# Altium schematic sheet 401_FramePWR.schdoc: Framework Modules Power
size A2; Organization: Greenfield Tech Solutions; Address1: Molendreef 33; Address2: Ossendrecht; Address3: 4641CS; Address4: The Netherlands; SheetNumber: 5; SheetTotal: 9
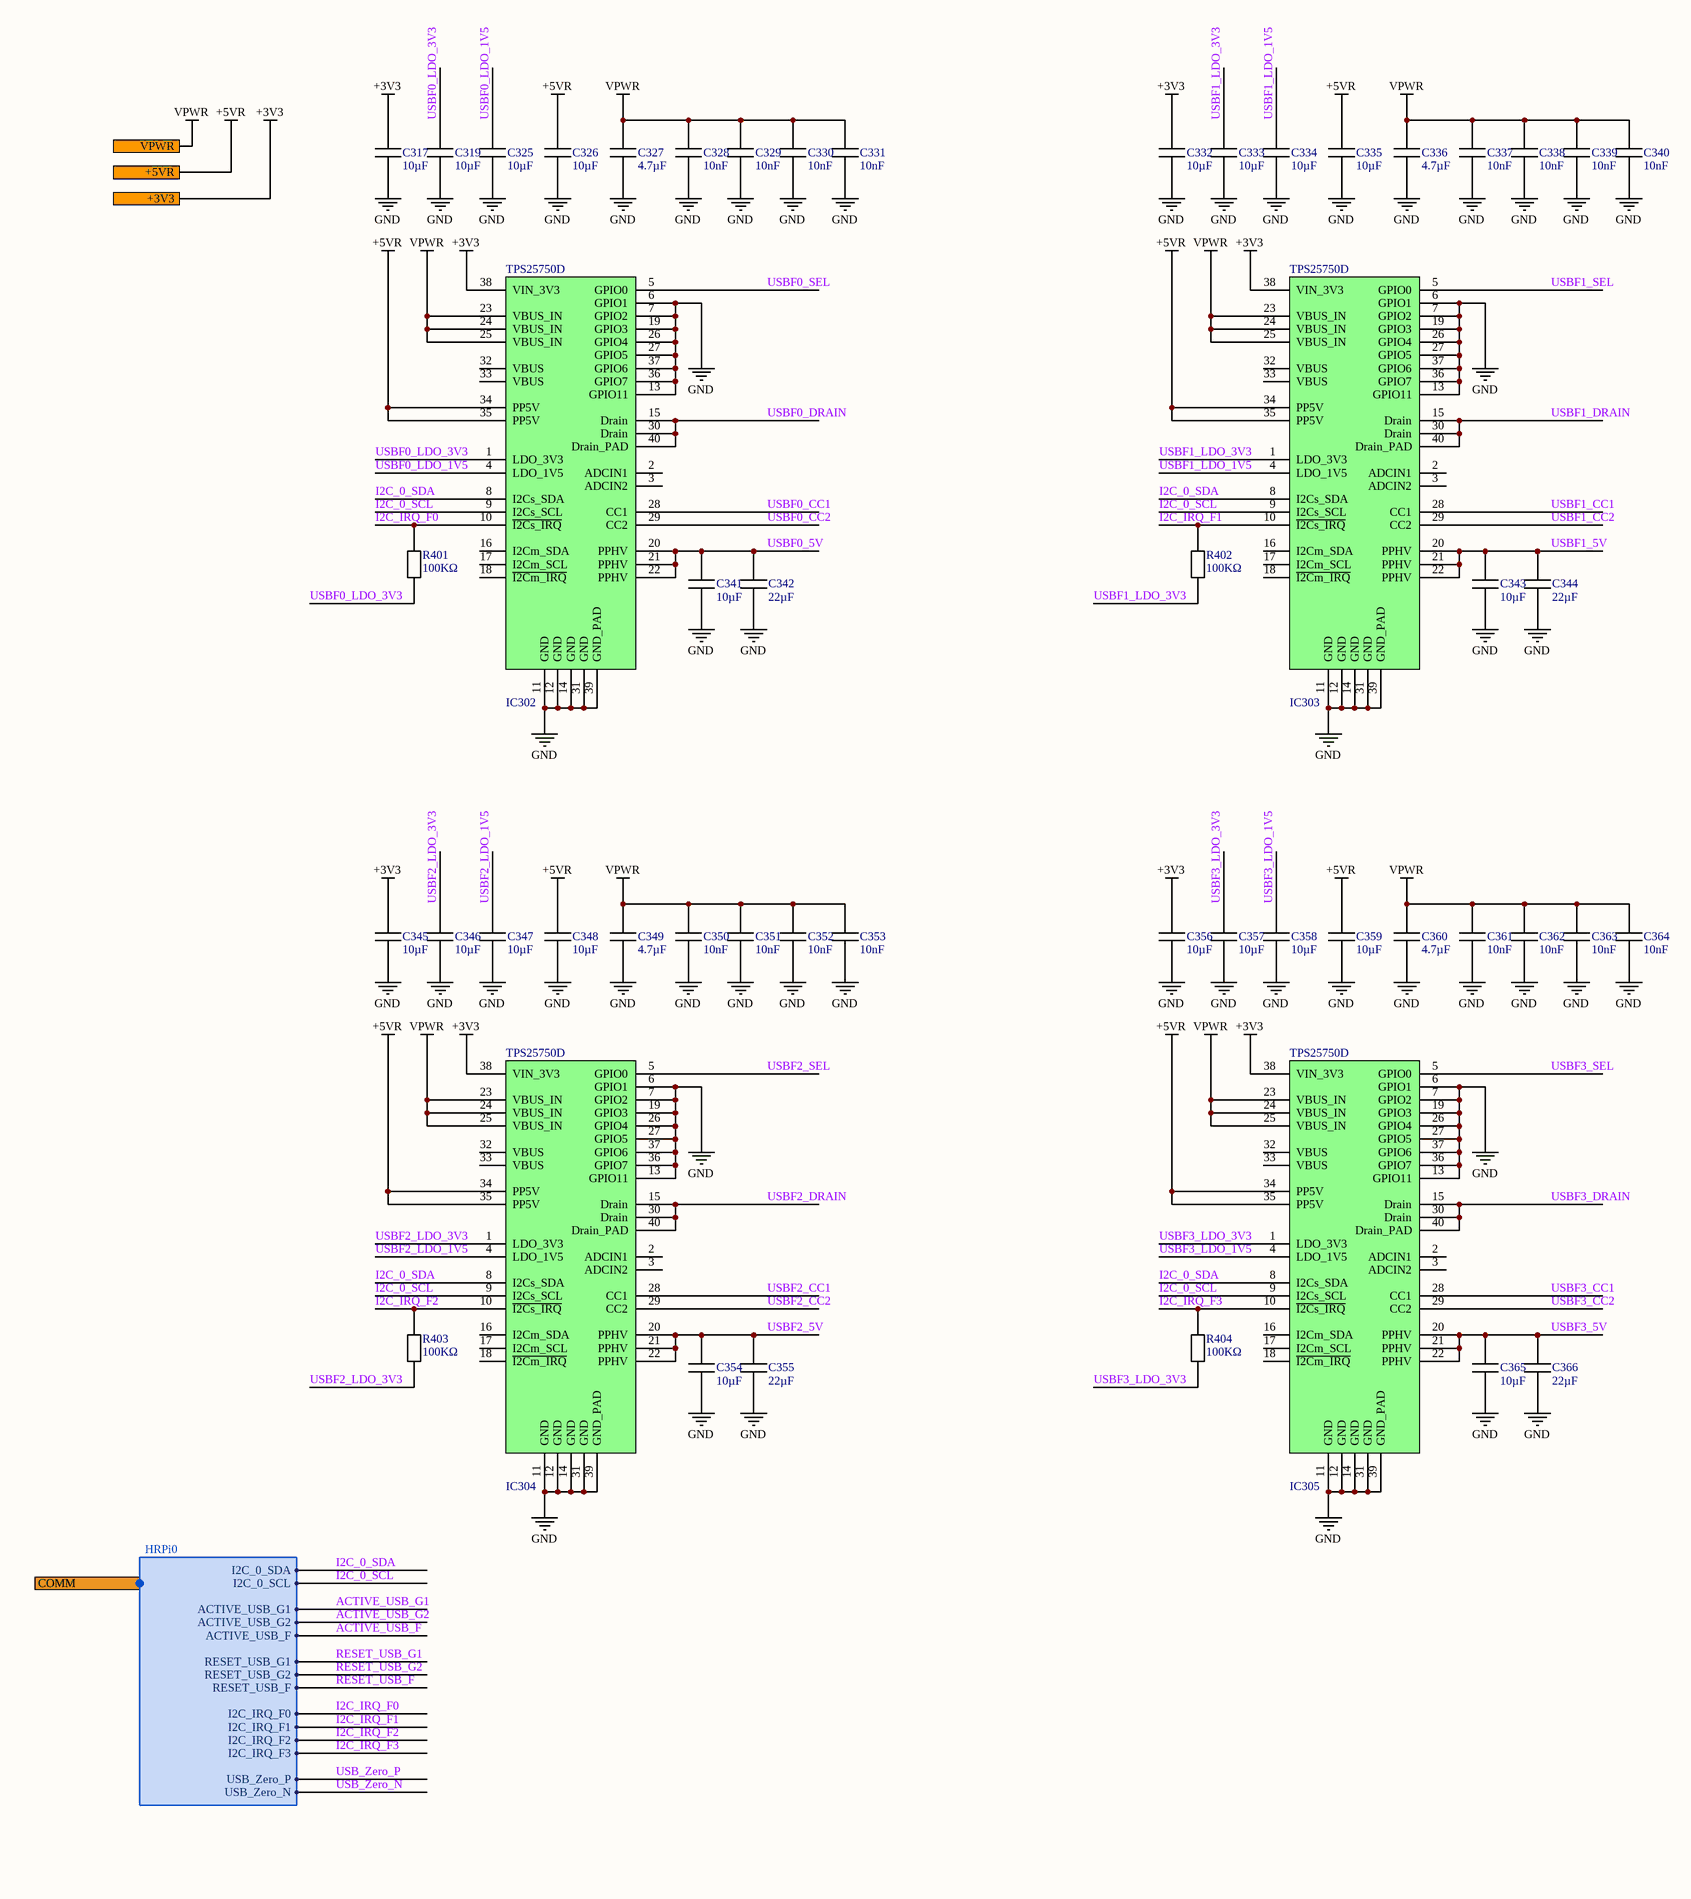
[diagram p0: 401_FramePWR.schdoc, left]
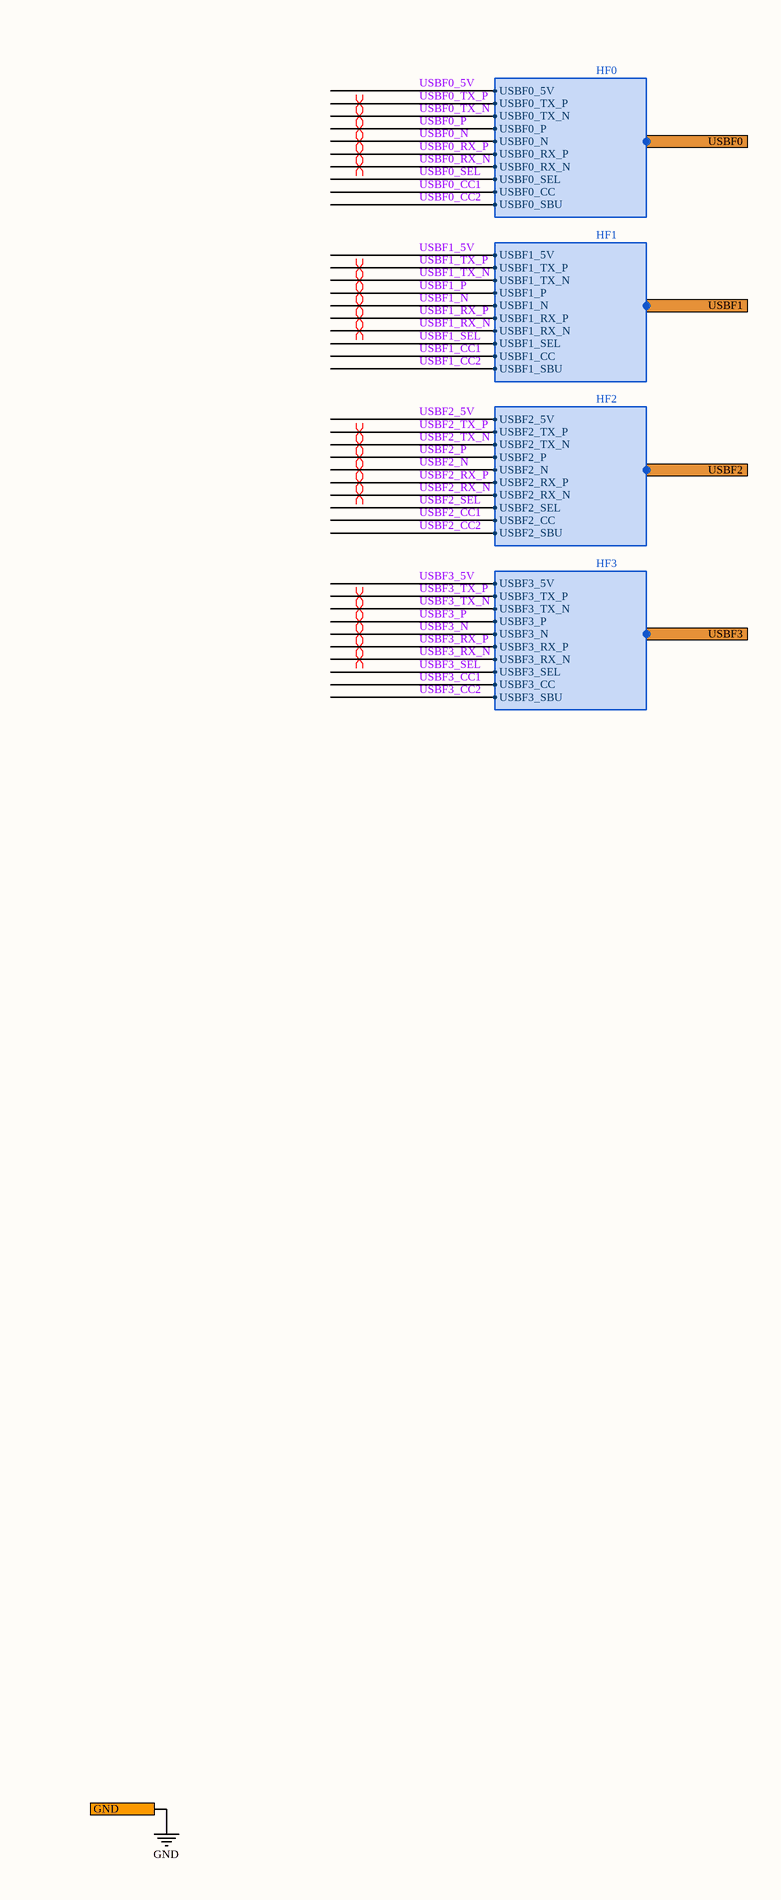
[diagram p1: 401_FramePWR.schdoc, right]

## Parts
C317  10µF  [C0805]
C319  10µF  [C0805]
C325  10µF  [C0805]
C326  10µF  [C0805]
C327  4.7µF  [C1210]
C328  10nF  [C0805]
C329  10nF  [C0805]
C330  10nF  [C0805]
C331  10nF  [C0805]
C332  10µF  [C0805]
C333  10µF  [C0805]
C334  10µF  [C0805]
C335  10µF  [C0805]
C336  4.7µF  [C1210]
C337  10nF  [C0805]
C338  10nF  [C0805]
C339  10nF  [C0805]
C340  10nF  [C0805]
C341  10µF  [C1210]
C342  22µF  [C2220]
C343  10µF  [C1210]
C344  22µF  [C2220]
C345  10µF  [C0805]
C346  10µF  [C0805]
C347  10µF  [C0805]
C348  10µF  [C0805]
C349  4.7µF  [C1210]
C350  10nF  [C0805]
C351  10nF  [C0805]
C352  10nF  [C0805]
C353  10nF  [C0805]
C354  10µF  [C1210]
C355  22µF  [C2220]
C356  10µF  [C0805]
C357  10µF  [C0805]
C358  10µF  [C0805]
C359  10µF  [C0805]
C360  4.7µF  [C1210]
C361  10nF  [C0805]
C362  10nF  [C0805]
C363  10nF  [C0805]
C364  10nF  [C0805]
C365  10µF  [C1210]
C366  22µF  [C2220]
IC302  TPS25750D  [QFNRJK-38]
IC303  TPS25750D  [QFNRJK-38]
IC304  TPS25750D  [QFNRJK-38]
IC305  TPS25750D  [QFNRJK-38]
R401  100KΩ  [R0402]
R402  100KΩ  [R0402]
R403  100KΩ  [R0402]
R404  100KΩ  [R0402]

## Ports
+3V3, +5VR, COMM (harness HRPi0), GND, USBF0 (harness HF0), USBF1 (harness HF1), USBF2 (harness HF2), USBF3 (harness HF3), VPWR

## Harnesses
HF0: USBF0_5V, USBF0_TX_P, USBF0_TX_N, USBF0_N, USBF0_RX_P, USBF0_RX_N, USBF0_SEL, USBF0_P, USBF0_CC, USBF0_SBU
HF1: USBF1_5V, USBF1_TX_P, USBF1_TX_N, USBF1_N, USBF1_RX_P, USBF1_RX_N, USBF1_SEL, USBF1_P, USBF1_CC, USBF1_SBU
HF2: USBF2_5V, USBF2_TX_P, USBF2_TX_N, USBF2_N, USBF2_RX_P, USBF2_RX_N, USBF2_SEL, USBF2_P, USBF2_CC, USBF2_SBU
HF3: USBF3_5V, USBF3_TX_P, USBF3_TX_N, USBF3_N, USBF3_RX_P, USBF3_RX_N, USBF3_SEL, USBF3_P, USBF3_CC, USBF3_SBU
HRPi0: I2C_0_SCL, I2C_0_SDA, I2C_IRQ_F0, I2C_IRQ_F1, I2C_IRQ_F3, I2C_IRQ_F2, ACTIVE_USB_G1, ACTIVE_USB_F, ACTIVE_USB_G2, RESET_USB_G1, RESET_USB_F, RESET_USB_G2, USB_Zero_N, USB_Zero_P

## Nets
+3V3: C317.1 C332.1 C345.1 C356.1 IC302.38(VIN_3V3) IC303.38(VIN_3V3) IC304.38(VIN_3V3) IC305.38(VIN_3V3) ; port +3V3
+5VR: C326.1 C335.1 C348.1 C359.1 IC302.34(PP5V) IC302.35(PP5V) IC303.34(PP5V) IC303.35(PP5V) IC304.34(PP5V) IC304.35(PP5V) IC305.34(PP5V) IC305.35(PP5V) ; port +5VR
GND: C317.2 C319.2 C325.2 C326.2 C327.2 C328.2 C329.2 C330.2 C331.2 C332.2 C333.2 C334.2 C335.2 C336.2 C337.2 C338.2 C339.2 C340.2 C341.2 C342.2 C343.2 C344.2 C345.2 C346.2 C347.2 C348.2 C349.2 C350.2 C351.2 C352.2 C353.2 C354.2 C355.2 C356.2 C357.2 C358.2 C359.2 C360.2 C361.2 C362.2 C363.2 C364.2 C365.2 C366.2 IC302.6(GPIO1) IC302.7(GPIO2) IC302.11(GND) IC302.12(GND) IC302.13(GPIO11) IC302.14(GND) IC302.19(GPIO3) IC302.26(GPIO4) IC302.27(GPIO5) IC302.31(GND) IC302.36(GPIO7) IC302.37(GPIO6) IC302.39(GND_PAD) IC303.6(GPIO1) IC303.7(GPIO2) IC303.11(GND) IC303.12(GND) IC303.13(GPIO11) IC303.14(GND) IC303.19(GPIO3) IC303.26(GPIO4) IC303.27(GPIO5) IC303.31(GND) IC303.36(GPIO7) IC303.37(GPIO6) IC303.39(GND_PAD) IC304.6(GPIO1) IC304.7(GPIO2) IC304.11(GND) IC304.12(GND) IC304.13(GPIO11) IC304.14(GND) IC304.19(GPIO3) IC304.26(GPIO4) IC304.27(GPIO5) IC304.31(GND) IC304.36(GPIO7) IC304.37(GPIO6) IC304.39(GND_PAD) IC305.6(GPIO1) IC305.7(GPIO2) IC305.11(GND) IC305.12(GND) IC305.13(GPIO11) IC305.14(GND) IC305.19(GPIO3) IC305.26(GPIO4) IC305.27(GPIO5) IC305.31(GND) IC305.36(GPIO7) IC305.37(GPIO6) IC305.39(GND_PAD) ; port GND
VPWR: C327.1 C328.1 C329.1 C330.1 C331.1 C336.1 C337.1 C338.1 C339.1 C340.1 C349.1 C350.1 C351.1 C352.1 C353.1 C360.1 C361.1 C362.1 C363.1 C364.1 IC302.23(VBUS_IN) IC302.24(VBUS_IN) IC302.25(VBUS_IN) IC303.23(VBUS_IN) IC303.24(VBUS_IN) IC303.25(VBUS_IN) IC304.23(VBUS_IN) IC304.24(VBUS_IN) IC304.25(VBUS_IN) IC305.23(VBUS_IN) IC305.24(VBUS_IN) IC305.25(VBUS_IN) ; port VPWR
ACTIVE_USB_F: port COMM.ACTIVE_USB_F
ACTIVE_USB_G1: port COMM.ACTIVE_USB_G1
ACTIVE_USB_G2: port COMM.ACTIVE_USB_G2
I2C_0_SCL: IC302.9(I2Cs_SCL) IC303.9(I2Cs_SCL) IC304.9(I2Cs_SCL) IC305.9(I2Cs_SCL) ; port COMM.I2C_0_SCL
I2C_0_SDA: IC302.8(I2Cs_SDA) IC303.8(I2Cs_SDA) IC304.8(I2Cs_SDA) IC305.8(I2Cs_SDA) ; port COMM.I2C_0_SDA
I2C_IRQ_F0: IC302.10(~{I2Cs_IRQ}) R401.2 ; port COMM.I2C_IRQ_F0
I2C_IRQ_F1: IC303.10(~{I2Cs_IRQ}) R402.2 ; port COMM.I2C_IRQ_F1
I2C_IRQ_F2: IC304.10(~{I2Cs_IRQ}) R403.2 ; port COMM.I2C_IRQ_F2
I2C_IRQ_F3: IC305.10(~{I2Cs_IRQ}) R404.2 ; port COMM.I2C_IRQ_F3
RESET_USB_F: port COMM.RESET_USB_F
RESET_USB_G1: port COMM.RESET_USB_G1
RESET_USB_G2: port COMM.RESET_USB_G2
USB_Zero_N: port COMM.USB_Zero_N
USB_Zero_P: port COMM.USB_Zero_P
USBF0_5V: C341.1 C342.1 IC302.20(PPHV) IC302.21(PPHV) IC302.22(PPHV) ; port USBF0.USBF0_5V
USBF0_CC1: IC302.28(CC1) ; port USBF0.USBF0_CC
USBF0_CC2: IC302.29(CC2) ; port USBF0.USBF0_SBU
USBF0_DRAIN: IC302.15(Drain) IC302.30(Drain) IC302.40(Drain_PAD)
USBF0_LDO_1V5: C325.1 IC302.4(LDO_1V5)
USBF0_LDO_3V3: C319.1 IC302.1(LDO_3V3) R401.1
USBF0_N: port USBF0.USBF0_N
USBF0_P: port USBF0.USBF0_P
USBF0_RX_N: port USBF0.USBF0_RX_N
USBF0_RX_P: port USBF0.USBF0_RX_P
USBF0_SEL: IC302.5(GPIO0) ; port USBF0.USBF0_SEL
USBF0_TX_N: port USBF0.USBF0_TX_N
USBF0_TX_P: port USBF0.USBF0_TX_P
USBF1_5V: C343.1 C344.1 IC303.20(PPHV) IC303.21(PPHV) IC303.22(PPHV) ; port USBF1.USBF1_5V
USBF1_CC1: IC303.28(CC1) ; port USBF1.USBF1_CC
USBF1_CC2: IC303.29(CC2) ; port USBF1.USBF1_SBU
USBF1_DRAIN: IC303.15(Drain) IC303.30(Drain) IC303.40(Drain_PAD)
USBF1_LDO_1V5: C334.1 IC303.4(LDO_1V5)
USBF1_LDO_3V3: C333.1 IC303.1(LDO_3V3) R402.1
USBF1_N: port USBF1.USBF1_N
USBF1_P: port USBF1.USBF1_P
USBF1_RX_N: port USBF1.USBF1_RX_N
USBF1_RX_P: port USBF1.USBF1_RX_P
USBF1_SEL: IC303.5(GPIO0) ; port USBF1.USBF1_SEL
USBF1_TX_N: port USBF1.USBF1_TX_N
USBF1_TX_P: port USBF1.USBF1_TX_P
USBF2_5V: C354.1 C355.1 IC304.20(PPHV) IC304.21(PPHV) IC304.22(PPHV) ; port USBF2.USBF2_5V
USBF2_CC1: IC304.28(CC1) ; port USBF2.USBF2_CC
USBF2_CC2: IC304.29(CC2) ; port USBF2.USBF2_SBU
USBF2_DRAIN: IC304.15(Drain) IC304.30(Drain) IC304.40(Drain_PAD)
USBF2_LDO_1V5: C347.1 IC304.4(LDO_1V5)
USBF2_LDO_3V3: C346.1 IC304.1(LDO_3V3) R403.1
USBF2_N: port USBF2.USBF2_N
USBF2_P: port USBF2.USBF2_P
USBF2_RX_N: port USBF2.USBF2_RX_N
USBF2_RX_P: port USBF2.USBF2_RX_P
USBF2_SEL: IC304.5(GPIO0) ; port USBF2.USBF2_SEL
USBF2_TX_N: port USBF2.USBF2_TX_N
USBF2_TX_P: port USBF2.USBF2_TX_P
USBF3_5V: C365.1 C366.1 IC305.20(PPHV) IC305.21(PPHV) IC305.22(PPHV) ; port USBF3.USBF3_5V
USBF3_CC1: IC305.28(CC1) ; port USBF3.USBF3_CC
USBF3_CC2: IC305.29(CC2) ; port USBF3.USBF3_SBU
USBF3_DRAIN: IC305.15(Drain) IC305.30(Drain) IC305.40(Drain_PAD)
USBF3_LDO_1V5: C358.1 IC305.4(LDO_1V5)
USBF3_LDO_3V3: C357.1 IC305.1(LDO_3V3) R404.1
USBF3_N: port USBF3.USBF3_N
USBF3_P: port USBF3.USBF3_P
USBF3_RX_N: port USBF3.USBF3_RX_N
USBF3_RX_P: port USBF3.USBF3_RX_P
USBF3_SEL: IC305.5(GPIO0) ; port USBF3.USBF3_SEL
USBF3_TX_N: port USBF3.USBF3_TX_N
USBF3_TX_P: port USBF3.USBF3_TX_P

Not connected (* = marked no-connect by the designer): IC302 2(ADCIN1) 3(ADCIN2) 16(I2Cm_SDA) 17(I2Cm_SCL) 18(~{I2Cm_IRQ}) 32(VBUS) 33(VBUS); IC303 2(ADCIN1) 3(ADCIN2) 16(I2Cm_SDA) 17(I2Cm_SCL) 18(~{I2Cm_IRQ}) 32(VBUS) 33(VBUS); IC304 2(ADCIN1) 3(ADCIN2) 16(I2Cm_SDA) 17(I2Cm_SCL) 18(~{I2Cm_IRQ}) 32(VBUS) 33(VBUS); IC305 2(ADCIN1) 3(ADCIN2) 16(I2Cm_SDA) 17(I2Cm_SCL) 18(~{I2Cm_IRQ}) 32(VBUS) 33(VBUS)

## Layout directives
differential pair; differential pair class USB3: USBF0_N, USBF0_P, USBF0_RX_N, USBF0_RX_P, USBF0_TX_N, USBF0_TX_P, USBF1_N, USBF1_P, USBF1_RX_N, USBF1_RX_P, USBF1_TX_N, USBF1_TX_P, USBF2_N, USBF2_P, USBF2_RX_N, USBF2_RX_P, USBF2_TX_N, USBF2_TX_P, USBF3_N, USBF3_P, USBF3_RX_N, USBF3_RX_P, USBF3_TX_N, USBF3_TX_P

## Notes on the sheet
- Title
- Size:
- Date:
- File:
- A2
- Number:
- Time:
- Revision:
- Sheet
- of

## Library data of the parts
C317 C319 C325 C326 C332-C335 C345-C348 C356-C359 = CA0001: 10µF 16V 10% X5R; Part Number: CA0001; ManfactPart: GRM21BR61C106KE15L; ID: 1; RefVal: 10µF
C327 C336 C349 C360 = CA0038: 4.7µF 100V 10% X5R; Part Number: CA0038; ManfactPart: HMK325BJ475KM-PE; ID: 38; RefVal: 4.7µF
C328-C331 C337-C340 C350-C353 C361-C364 = CA0021: 10nF 50V 10% X7R; Part Number: CA0021; ManfactPart: C0805C103K5RAC; ID: 21; RefVal: 10nF
C341 C343 C354 C365 = CA0039: 10µF 63V 10% X7R; Part Number: CA0039; ManfactPart: CL32B106KMVNNWE; ID: 39; RefVal: 10µF
C342 C344 C355 C366 = CA0051: 22µF 63V 20% X7R; Part Number: CA0051; ManfactPart: KRM55WR71J226MH01K; ID: 51; RefVal: 22µF
IC302-IC305 = IC0041: USB Type-C and USB PD Controller with Integrated Power Switches Optimized for Power Applications; Part Number: IC0041; ID: 41; RefVal: TPS25750D; ManfactPart: TPS25750D
R401-R404 = RS0036: 100KΩ 1% 62.5mW 100PPM; Part Number: RS0036; ManfactPart: AC0402FR-13100KL; ID: 36; RefVal: 100KΩ